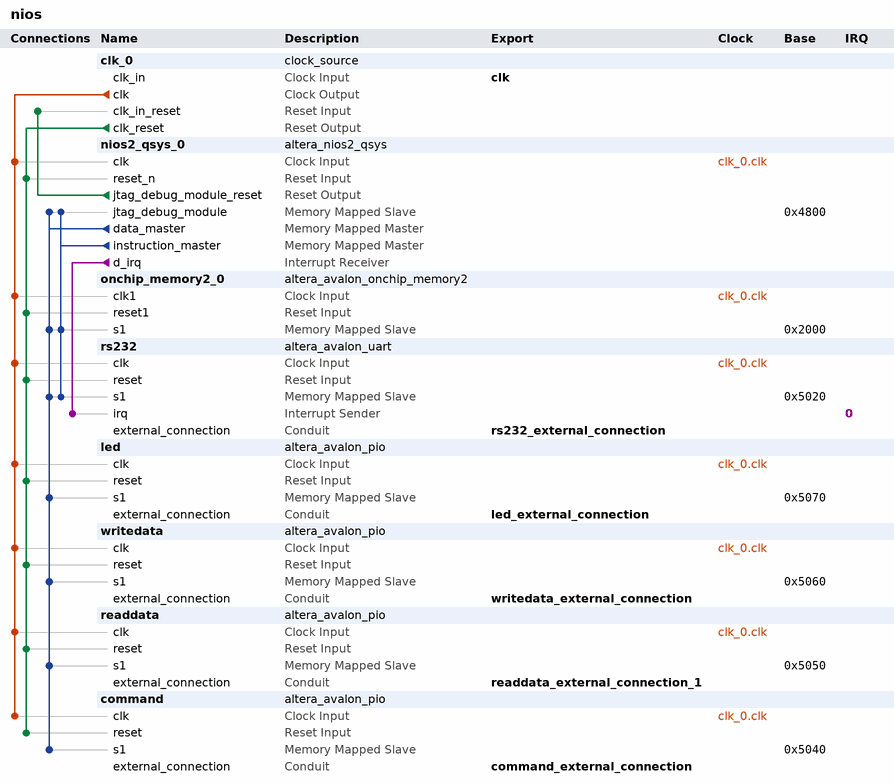
[diagram p0: system contents]
# Platform Designer (Qsys) system nios, Cyclone II EP2C35F672C6
# Parameters at their usual value, and those the tool derives, are not listed.
package require -exact qsys 13.0.1.99.2
create_system nios
set_project_property DEVICE_FAMILY {Cyclone II}
set_project_property DEVICE EP2C35F672C6

add_instance clk_0 clock_source 13.0
set_instance_parameter_value clk_0 clockFrequency 50000000

add_instance nios2_qsys_0 altera_nios2_qsys 13.0
set_instance_parameter_value nios2_qsys_0 resetSlave onchip_memory2_0.s1
set_instance_parameter_value nios2_qsys_0 mmu_TLBMissExcSlave None
set_instance_parameter_value nios2_qsys_0 exceptionSlave onchip_memory2_0.s1
set_instance_parameter_value nios2_qsys_0 breakSlave nios2_qsys_0.jtag_debug_module
set_instance_parameter_value nios2_qsys_0 impl Fast
set_instance_parameter_value nios2_qsys_0 icache_size 4096

add_instance onchip_memory2_0 altera_avalon_onchip_memory2 13.0.1.99.2
set_instance_parameter_value onchip_memory2_0 dataWidth 32
set_instance_parameter_value onchip_memory2_0 dualPort false
set_instance_parameter_value onchip_memory2_0 initMemContent true
set_instance_parameter_value onchip_memory2_0 initializationFileName "C:\\Users\\User\\Documents\\nios_repo\\nios\\software\\nios\\mem_init\\nios_onchip_memory2_0.hex"
set_instance_parameter_value onchip_memory2_0 memorySize 8192
set_instance_parameter_value onchip_memory2_0 useNonDefaultInitFile true

add_instance rs232 altera_avalon_uart 13.0.1.99.2
set_instance_parameter_value rs232 baud 115200
set_instance_parameter_value rs232 dataBits 8
set_instance_parameter_value rs232 fixedBaud true
set_instance_parameter_value rs232 parity NONE
set_instance_parameter_value rs232 stopBits 1

add_instance led altera_avalon_pio 13.0.1.99.2
set_instance_parameter_value led direction Output
set_instance_parameter_value led width 8

add_instance writedata altera_avalon_pio 13.0.1.99.2
set_instance_parameter_value writedata direction InOut
set_instance_parameter_value writedata width 8

add_instance readdata altera_avalon_pio 13.0.1.99.2
set_instance_parameter_value readdata direction InOut
set_instance_parameter_value readdata width 8

add_instance command altera_avalon_pio 13.0.1.99.2
set_instance_parameter_value command direction InOut
set_instance_parameter_value command width 3

# connections
add_connection clk_0.clk command.clk clock
add_connection clk_0.clk led.clk clock
add_connection clk_0.clk nios2_qsys_0.clk clock
add_connection clk_0.clk onchip_memory2_0.clk1 clock
add_connection clk_0.clk readdata.clk clock
add_connection clk_0.clk rs232.clk clock
add_connection clk_0.clk writedata.clk clock
add_connection clk_0.clk_reset command.reset reset
add_connection clk_0.clk_reset led.reset reset
add_connection clk_0.clk_reset nios2_qsys_0.reset_n reset
add_connection clk_0.clk_reset onchip_memory2_0.reset1 reset
add_connection clk_0.clk_reset readdata.reset reset
add_connection clk_0.clk_reset rs232.reset reset
add_connection clk_0.clk_reset writedata.reset reset
add_connection nios2_qsys_0.jtag_debug_module_reset clk_0.clk_in_reset reset
add_connection nios2_qsys_0.data_master command.s1 avalon
set_connection_parameter_value nios2_qsys_0.data_master/command.s1 baseAddress 0x5040
add_connection nios2_qsys_0.data_master led.s1 avalon
set_connection_parameter_value nios2_qsys_0.data_master/led.s1 baseAddress 0x5070
add_connection nios2_qsys_0.data_master nios2_qsys_0.jtag_debug_module avalon
set_connection_parameter_value nios2_qsys_0.data_master/nios2_qsys_0.jtag_debug_module baseAddress 0x4800
add_connection nios2_qsys_0.data_master onchip_memory2_0.s1 avalon
set_connection_parameter_value nios2_qsys_0.data_master/onchip_memory2_0.s1 baseAddress 0x2000
add_connection nios2_qsys_0.data_master readdata.s1 avalon
set_connection_parameter_value nios2_qsys_0.data_master/readdata.s1 baseAddress 0x5050
add_connection nios2_qsys_0.data_master rs232.s1 avalon
set_connection_parameter_value nios2_qsys_0.data_master/rs232.s1 baseAddress 0x5020
add_connection nios2_qsys_0.data_master writedata.s1 avalon
set_connection_parameter_value nios2_qsys_0.data_master/writedata.s1 baseAddress 0x5060
add_connection nios2_qsys_0.instruction_master nios2_qsys_0.jtag_debug_module avalon
set_connection_parameter_value nios2_qsys_0.instruction_master/nios2_qsys_0.jtag_debug_module baseAddress 0x4800
add_connection nios2_qsys_0.instruction_master onchip_memory2_0.s1 avalon
set_connection_parameter_value nios2_qsys_0.instruction_master/onchip_memory2_0.s1 baseAddress 0x2000
add_connection nios2_qsys_0.instruction_master rs232.s1 avalon
set_connection_parameter_value nios2_qsys_0.instruction_master/rs232.s1 baseAddress 0x5020
add_connection nios2_qsys_0.d_irq rs232.irq interrupt
set_connection_parameter_value nios2_qsys_0.d_irq/rs232.irq irqNumber 0

# exported interfaces
add_interface clk clock sink
set_interface_property clk EXPORT_OF clk_0.clk_in
add_interface led_external_connection conduit end
set_interface_property led_external_connection EXPORT_OF led.external_connection
add_interface rs232_external_connection conduit end
set_interface_property rs232_external_connection EXPORT_OF rs232.external_connection
add_interface writedata_external_connection conduit end
set_interface_property writedata_external_connection EXPORT_OF writedata.external_connection
add_interface readdata_external_connection_1 conduit end
set_interface_property readdata_external_connection_1 EXPORT_OF readdata.external_connection
add_interface command_external_connection conduit end
set_interface_property command_external_connection EXPORT_OF command.external_connection

set_interconnect_requirement {$system} qsys_mm.clockCrossingAdapter HANDSHAKE
set_interconnect_requirement {$system} qsys_mm.maxAdditionalLatency 1

save_system nios.qsys
